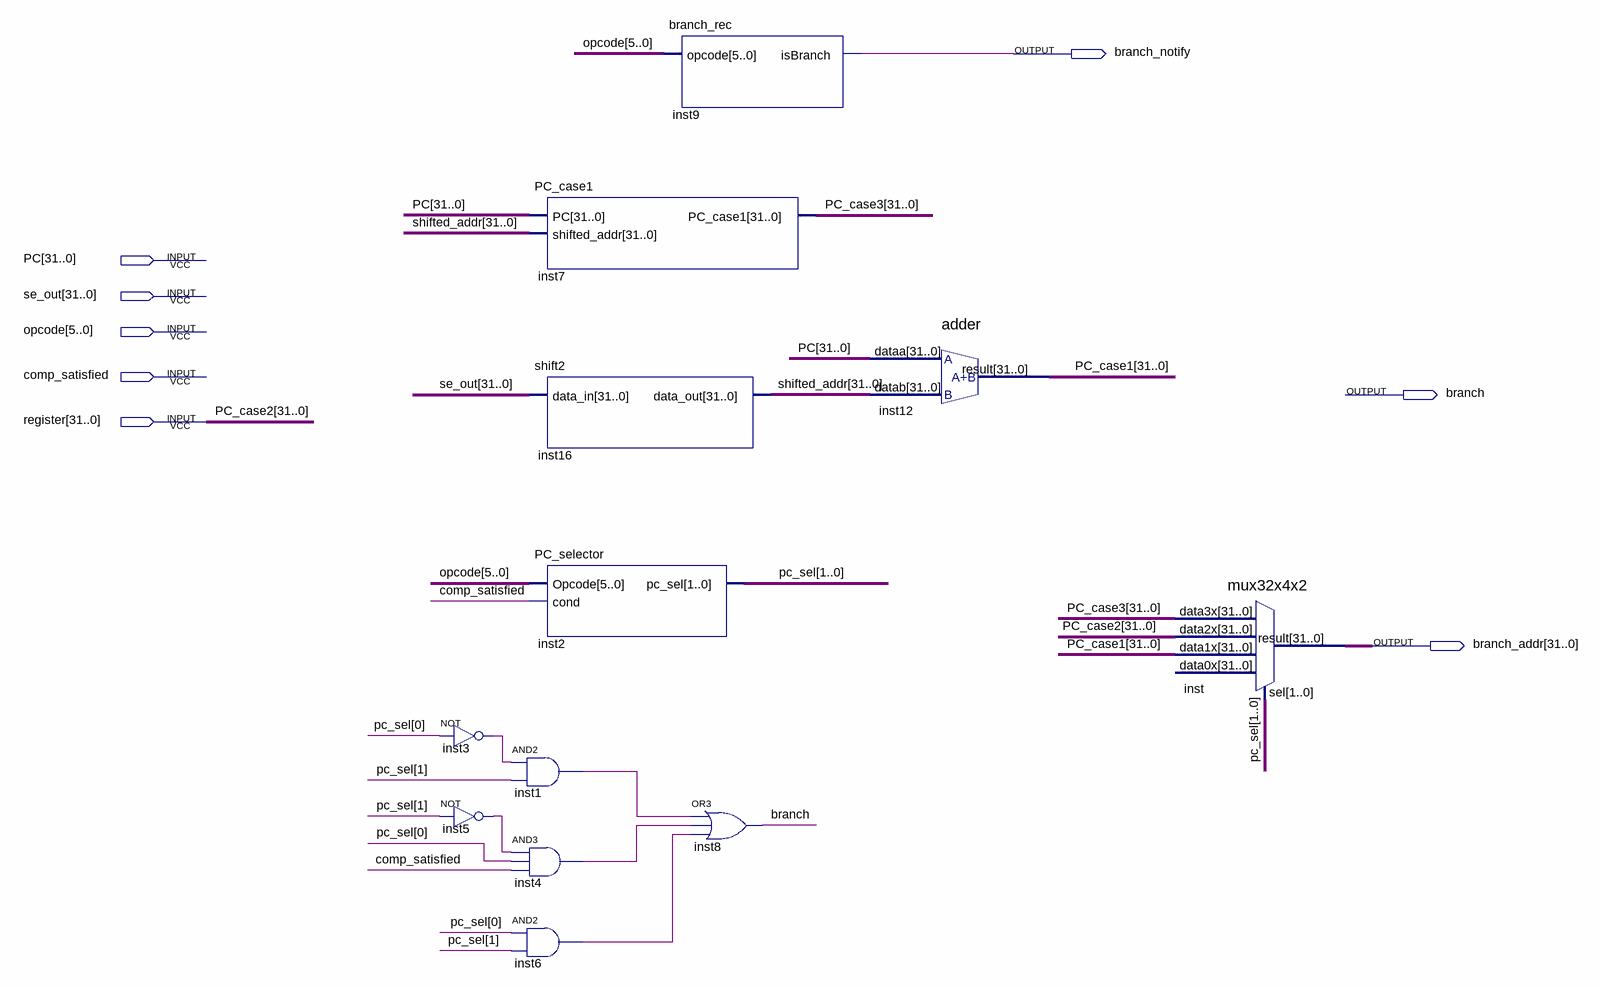
[diagram p0: schematic sheet]
// Quartus schematic branch_DEC.bdf as structural Verilog: 12 symbols, 8 pins
module branch_DEC (
  input  [31:0] PC,
  input  [31:0] se_out,
  input  [5:0] opcode,
  input  comp_satisfied,
  input  [31:0] register,
  output branch_notify,
  output branch,
  output [31:0] branch_addr
);

  wire inst1_out, inst3_out, inst4_out, inst5_out, inst6_out;
  wire [1:0] pc_sel;
  wire [31:0] PC_case1, PC_case3, shifted_addr;

  not inst3 (inst3_out, pc_sel[0]);
  not inst5 (inst5_out, pc_sel[1]);
  and inst1 (inst1_out, inst3_out, pc_sel[1]);
  and inst4 (inst4_out, inst5_out, pc_sel[0], comp_satisfied);
  and inst6 (inst6_out, pc_sel[0], pc_sel[1]);
  PC_case1 inst7 (.PC(PC), .shifted_addr(shifted_addr), .PC_case1(PC_case3));
  shift2 inst16 (.data_in(se_out), .data_out(shifted_addr));
  PC_selector inst2 (.Opcode(opcode), .cond(comp_satisfied), .pc_sel(pc_sel));
  branch_rec inst9 (.opcode(opcode), .isBranch(branch_notify));
  or inst8 (branch, inst1_out, inst4_out, inst6_out);
  adder inst12 (.dataa(PC), .datab(shifted_addr), .result(PC_case1));
  mux32x4x2 inst (
    .data3x(PC_case3), .data2x(register), .data1x(PC_case1), .sel(pc_sel), .result(branch_addr));  // open: data0x

  // Other names for the same wires on the sheet: PC_case2[31:0] = register
endmodule
